# EAGLE design Headphone-Amplifier-ClassAB (EAGLE 7.2.0)
4x4 - Three Transistor Headphone Amplifier - Class AB http://www.electronics-diy.com/4x4.php
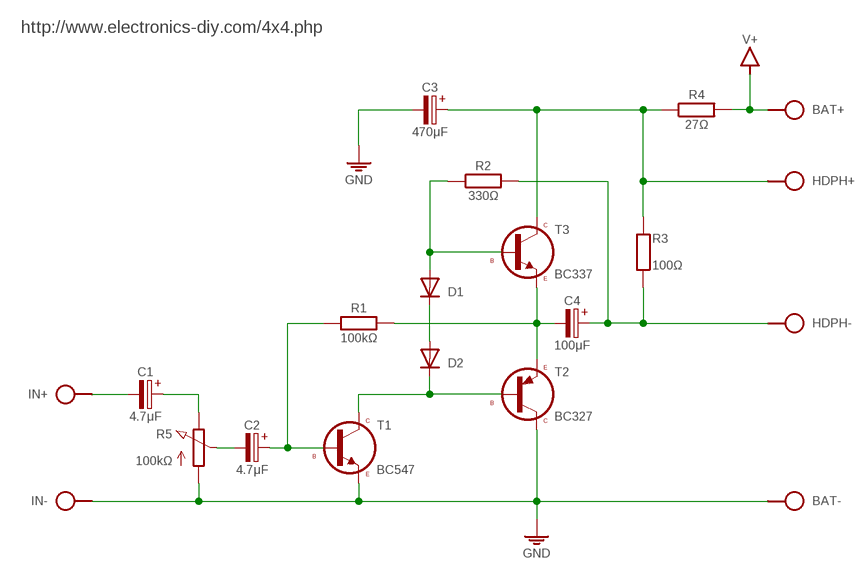
[diagram p0: schematic, sheet 1]

## Parts
BAT  SPAD+-+-  [SPAD+-]
C1  4.7μF  CPOLE2,5-4  [E2,5-4]
C2  4.7μF  CPOLE2,5-4  [E2,5-4]
C3  470μF  CPOLE5-6  [E5-6]
C4  100μF  CPOLE5-4  [E5-4]
D1  1N414834-5V  [DO34-5V]
D2  1N414834-5V  [DO34-5V]
HDPH  SPAD+--+  [SPAD-+]
IN  SPAD+--+  [SPAD-+]
R1  100kΩ  R-H0202/7  [0202/7]
R2  330Ω  R-H0204/10  [0204/10]
R3  100Ω  R0204/10  [0204/10]
R4  27Ω  R-H-V-X  [0204V]
R5  100kΩ  POT-3P  [CONN-3P]
T1  BC547  [TO92]
T2  BC327  [TO92]
T3  BC337  BC337CBE  [TO92-CBE]

## Nets
GND: BAT.1 C3.- IN.1 R5.1(A) T1.3(E) T2.1(C)
N$1: D1.A R2.1 T3.2(B)
N$2: D2.C T1.1(C) T2.2(B)
N$3: D1.C D2.A
N$4: C4.- R1.2 T2.3(E) T3.3(E)
N$5: C1.+ R5.3(E)
N$6: C2.- R5.2(S)
N$7: C2.+ R1.1 T1.2(B)
N$8: C3.+ HDPH.2 R3.2 R4.2 T3.1(C)
N$9: C4.+ HDPH.1 R2.2 R3.1
N$10: C1.- IN.2
V+: BAT.2 R4.1

## Notes on the sheet
- http://www.electronics-diy.com/4x4.php

## Library data of the parts
BAT HDPH IN = pad:SPAD+-
C1-C4 = c:CPOL: POLARIZED CAPACITOR, European symbol
D1 D2 = d:1N4148
R1 R2 R4 = r:R-H
R3 = r:R: RESISTOR, European symbol
R5 = r:POT
T1 = t:BC547
T2 = t:BC327
T3 = t:BC337

## Net classes
0 default: width 0.61 mm

## Board
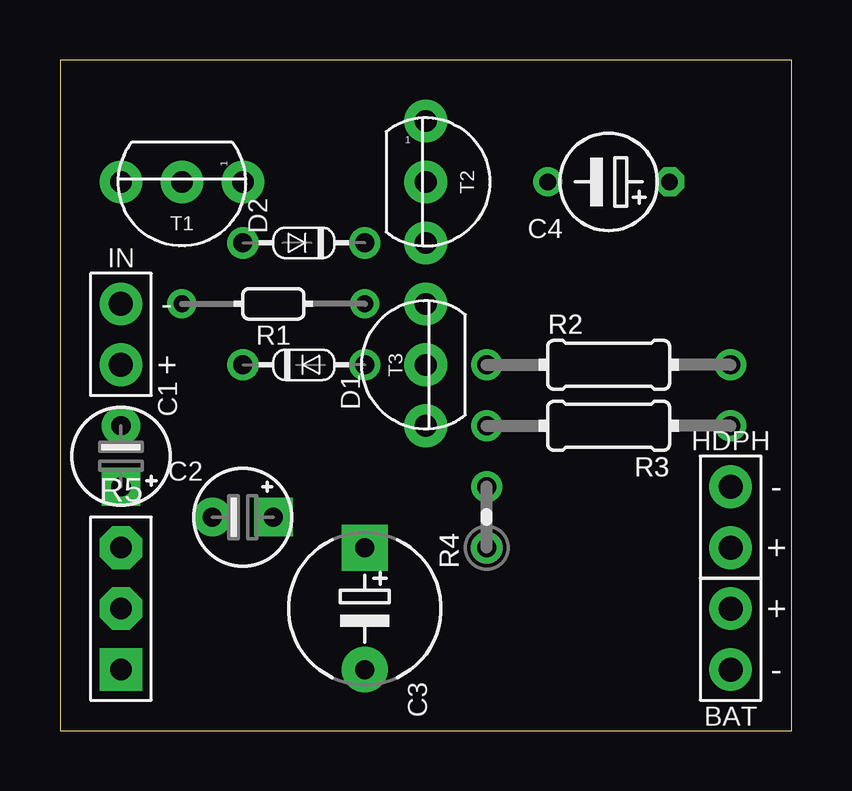
[diagram p1: board, top side]
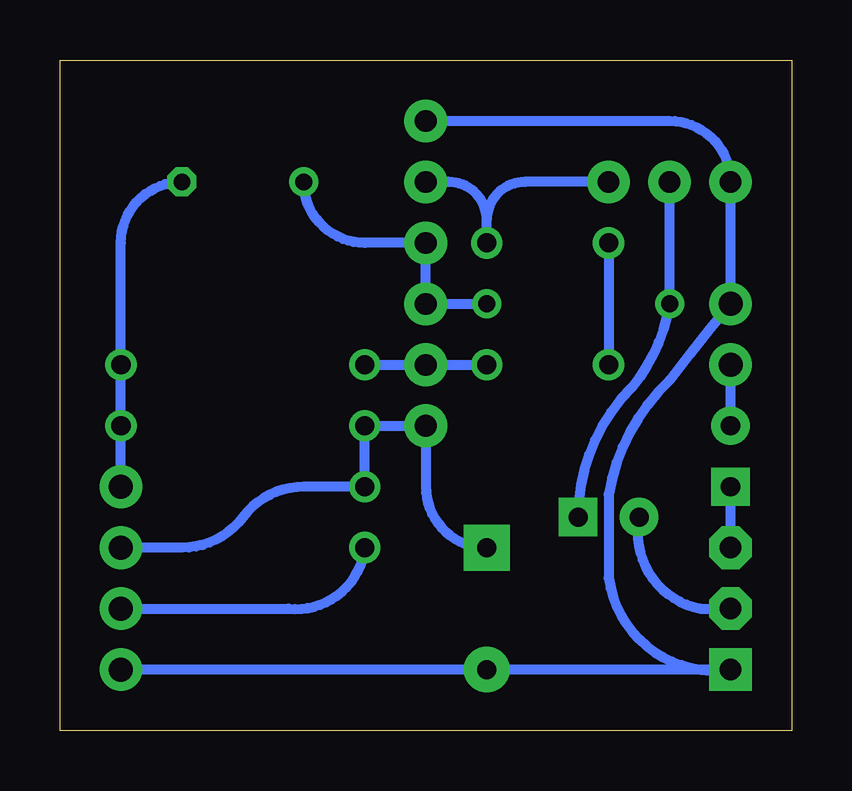
[diagram p2: board, bottom side, seen from below]

Size 30.48 x 27.94 mm. Coordinates in mm from the lower left corner, seen from the top.
Outline: 0,0 30.48,0 30.48,27.94 0,27.94 0,0
Copper layers (1*16): Top 0.035mm / dielectric 1.5mm / Bottom 0.035mm
Design rules "default": minimum track width 10mil, minimum drill 24mil, track to track 8mil, track to pad 8mil, pad to pad 8mil, via to via 8mil, smd to smd 8mil, copper to edge 40mil, drill to drill 8mil, minimum pad ring 10mil, minimum via ring 8mil, stop-mask expansion 4mil, vias tented up to drill 0mil, thermal gap 10mil

### Footprints (pad centres in the part's own frame; a part is rotated, then mirrored left to right if it is on the bottom)
SPAD+- = drill 1 pad 1.778: 1 0,-1.27; 2 0,1.27
E2,5-4 = drill 0.8 pad 1.6 square: + 1.27,0 | drill 0.8 pad 1.6: - -1.27,0
E5-6 = drill 0.8 pad 1.905 square: + -2.54,0 | drill 0.8 pad 1.905: - 2.54,0
E5-4 = drill 0.7 octagon: + -2.54,0 | drill 0.7: - 2.54,0
DO34-5V = drill 0.8: A 0,2.54; C 0,-2.54
SPAD-+ = drill 1 pad 1.778: 1 0,-1.27; 2 0,1.27
0202/7 = drill 0.7: 1 0,3.81; 2 0,-3.81
0204/10 = drill 0.8: 1 -5.08,0; 2 5.08,0
0204V = drill 0.8: 1 -1.27,0; 2 1.27,0
CONN-3P = drill 0.9 pad 1.778 square: 1 0,-2.54 | drill 0.9 pad 1.778 octagon: 2 0,0; 3 0,2.54
TO92 = drill 0.9 pad 1.778: 1 0,2.54; 2 0,0; 3 0,-2.54
TO92-CBE = drill 0.9 pad 1.778: 1 0,2.54; 2 0,0; 3 0,-2.54

### Placement (x,y rotation side)
BAT  27.94,3.81 0 top
C1  2.54,11.43 270 top
C2  7.62,8.89 0 top
C3  12.7,5.08 270 top
C4  22.86,22.86 180 top
D1  10.16,15.24 270 top
D2  10.16,20.32 90 top
HDPH  27.94,8.89 180 top
IN  2.54,16.51 180 top
R1  8.89,17.78 90 top
R2  22.86,15.24 0 top
R3  22.86,12.7 180 top
R4  17.78,8.89 90 top
R5  2.54,5.08 0 top
T1  5.08,22.86 270 top
T2  15.24,22.86 0 top
T3  15.24,15.24 180 top

### Tracks (layer width: path | path; a pad name or v marks a point on that pad's centre or on a via)
GND
  Bottom 0.406: T2.1 5.08,25.4 arc90 T1.3 IN.1 arc-2 5.08,14.61 arc-37 7.62,9.84 7.62,6.35 arc-90 R5.1 C3.- BAT.1
N$1
  Bottom 0.406: R2.1 T3.2 D1.A
N$2
  Bottom 0.406: T1.1 11.11,22.86 arc-90 12.7,21.27 | D2.C 12.7,21.27 | 12.7,21.27 arc-90 14.29,22.86 T2.2
N$3
  Bottom 0.406: D2.A D1.C
N$4
  Bottom 0.406: C4.- arc-90 17.78,20.32 T2.3 T3.3 R1.2
N$5
  Bottom 0.406: R5.3 C1.+
N$6
  Bottom 0.406: C2.- arc-90 3.81,5.08 R5.2
N$7
  Bottom 0.406: T1.2 R1.1 arc30 6.67,14.29 arc-45 C2.+
N$8
  Bottom 0.406: HDPH.2 25.4,7.62 arc-53 22.86,8.89 arc53 20.32,10.16 R4.2 R3.2 T3.1 15.24,10.16 arc-90 C3.+
N$9
  Bottom 0.406: C4.+ arc-90 27.94,20.32 R2.2 R3.1 HDPH.1
N$10
  Bottom 0.406: C1.- IN.2
V+
  Bottom 0.406: BAT.2 20.95,5.08 arc-90 R4.1